# Altium schematic sheet USB_ETH_Sch.SchDoc
size A; PageSetup: Record=PageOptions|CenterHorizontal=True|CenterVertical=True|PrintScale=1.11|XCorrection=1.00|YCorrection=1.00|PrintKind=0|BorderSize=5000000|LeftOffset=0|BottomOffset=0|Orientation=2|PaperLength=1000|PaperWidth=1000|Scale=100|PaperSource=7|PrintQuality=-4|MediaType=1|DitherType=10|PaperKind=Letter|PrintScaleMode=1
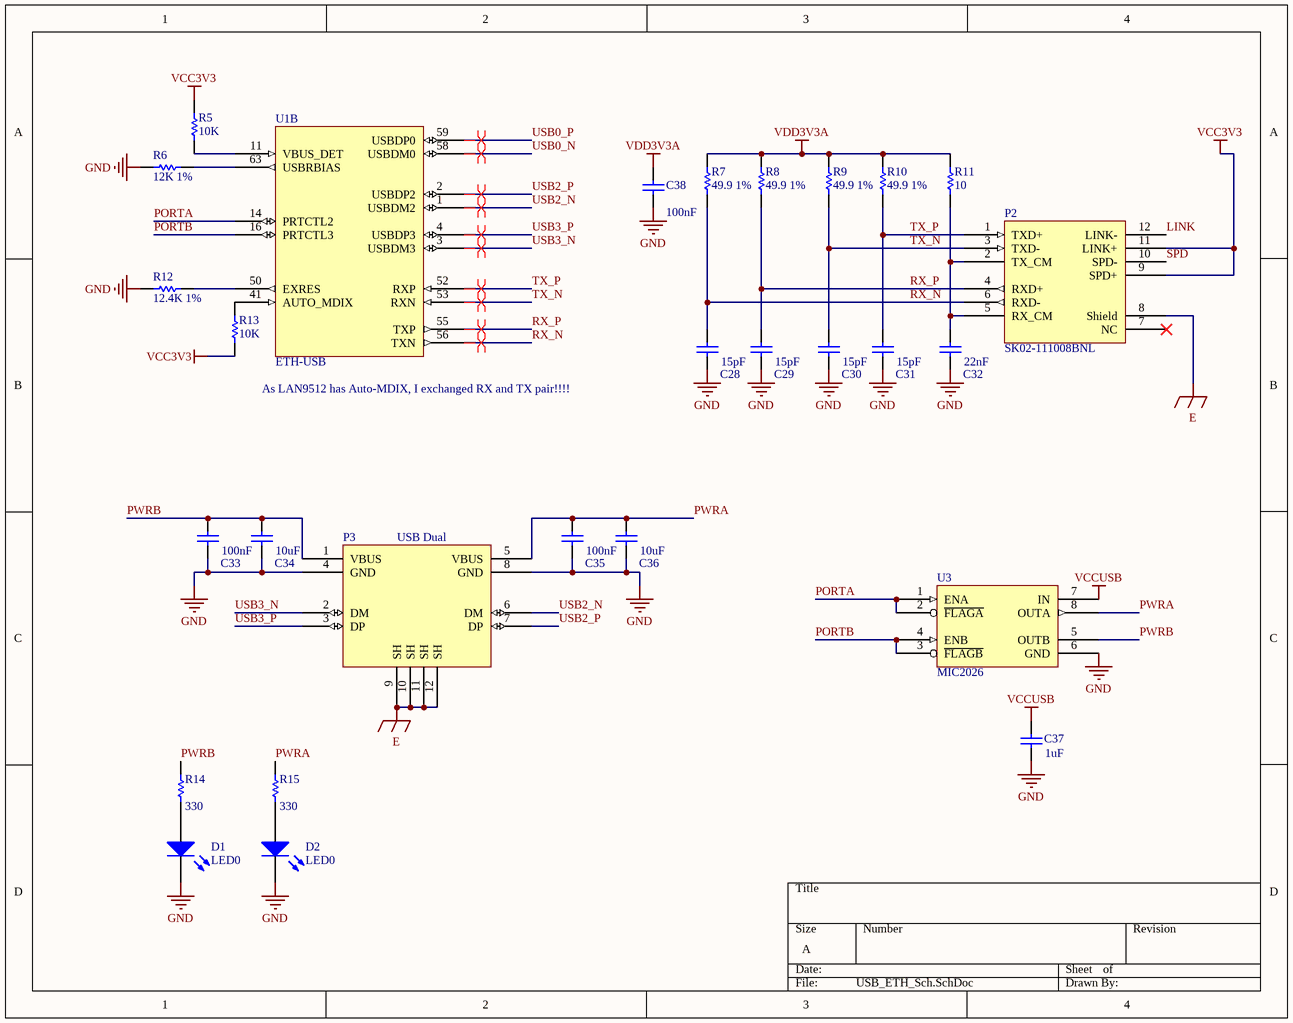
[diagram p0: USB_ETH_Sch.SchDoc]

## Parts
C28  value 15pF  [C0805]  (hidden comment: Cap)
C29  value 15pF  [C0805]  (hidden comment: Cap)
C30  value 15pF  [C0805]  (hidden comment: Cap)
C31  value 15pF  [C0805]  (hidden comment: Cap)
C32  value 22nF  [C0805]  (hidden comment: Cap)
C33  value 100nF  [C0805]  (hidden comment: Cap)
C34  value 10uF  [C0805]  (hidden comment: Cap)
C35  value 100nF  [C0805]  (hidden comment: Cap)
C36  value 10uF  [C0805]  (hidden comment: Cap)
C37  value 1uF  [C0805]  (hidden comment: Cap)
C38  value 100nF  [C0805]  (hidden comment: Cap)
D1  LED0  [SMD_LED_1206]
D2  LED0  [SMD_LED_1206]
P2  SK02-111008BNL  [RJ45+MAG]
P3  USB Dual  [USB_Duble]
R5  value 10K  [c0805]  (hidden comment: Res1)
R6  value 12K 1%  [c0805]  (hidden comment: Res1)
R7  value 49.9 1%  [c0805]  (hidden comment: Res1)
R8  value 49.9 1%  [c0805]  (hidden comment: Res1)
R9  value 49.9 1%  [c0805]  (hidden comment: Res1)
R10  value 49.9 1%  [c0805]  (hidden comment: Res1)
R11  value 10  [c0805]  (hidden comment: Res1)
R12  value 12.4K 1%  [c0805]  (hidden comment: Res1)
R13  value 10K  [c0805]  (hidden comment: Res1)
R14  value 330  [C1206]  (hidden comment: Res1)
R15  value 330  [C1206]  (hidden comment: Res1)
U1  ETH-USB  [QFN64]  (part B of 3)
U3  MIC2026  [SSOP8]

## Nets
E: P2.8(Shield) P3.9(SH) P3.10(SH) P3.11(SH) P3.12(SH)
GND: C28.1 C29.1 C30.1 C31.1 C32.1 C33.1 C34.1 C35.1 C36.1 C37.1 C38.1 D1.2(K) D2.2(K) P3.4(GND) P3.8(GND) R6.1 R12.1 U3.6(GND)
VCC3V3: P2.9(SPD+) P2.11(LINK+) R5.1 R13.1
VCCUSB: C37.2 U3.7(IN)
VDD3V3A: C38.2 R7.2 R8.2 R9.2 R10.2 R11.2
LINK: P2.12(LINK-)
PORTA: U1.14(PRTCTL2) U3.1(ENA) U3.2(~{FLAGA})
PORTB: U1.16(PRTCTL3) U3.3(~{FLAGB}) U3.4(ENB)
PWRA: C35.2 C36.2 P3.5(VBUS) R15.2 U3.8(OUTA)
PWRB: C33.2 C34.2 P3.1(VBUS) R14.2 U3.5(OUTB)
RX_N: C28.2 P2.6(RXD-) R7.1 U1.56(TXN)
RX_P: C29.2 P2.4(RXD+) R8.1 U1.55(TXP)
SPD: P2.10(SPD-)
TX_N: C30.2 P2.3(TXD-) R9.1 U1.53(RXN)
TX_P: C31.2 P2.1(TXD+) R10.1 U1.52(RXP)
USB0_N: U1.58(USBDM0)
USB0_P: U1.59(USBDP0)
USB2_N: P3.6(DM) U1.1(USBDM2)
USB2_P: P3.7(DP) U1.2(USBDP2)
USB3_N: P3.2(DM) U1.3(USBDM3)
USB3_P: P3.3(DP) U1.4(USBDP3)
NetC32_2: C32.2 P2.2(TX_CM) P2.5(RX_CM) R11.1
NetD1_1: D1.1(A) R14.1
NetD2_1: D2.1(A) R15.1
NetR5_2: R5.2 U1.11(VBUS_DET)
NetR6_2: R6.2 U1.63(USBRBIAS)
NetR12_2: R12.2 U1.50(EXRES)
NetR13_2: R13.2 U1.41(AUTO_MDIX)

Not connected (* = marked no-connect by the designer): P2 7(NC)*

## Layout directives
differential pair: RX_N, RX_P, TX_N, TX_P, USB0_N, USB0_P, USB2_N, USB2_P, USB3_N, USB3_P

## Notes on the sheet
- As LAN9512 has Auto-MDIX, I exchanged RX and TX pair!!!!

## Library data of the parts
C28-C38 = Cap: Capacitor; Published: 8-Jun-2000; LatestRevisionDate: 17-Jul-2002; LatestRevisionNote: Re-released for DXP Platform.; PackageReference: RAD-0.3; Publisher: Altium Limited; PackageDescription: Radial Cap, Thru-Hole; 2 Leads; 0.3 in Pin Spacing
D1 D2 = LED0: Typical INFRARED GaAs LED; Published: 8-Jun-2000; LatestRevisionDate: 08-Jul-2005; LatestRevisionNote: Mech Layer 1 removed.; PackageReference: LED-0; Publisher: Altium Limited; PackageDescription: LED; 2 Leads
P2 = SK02-111008BNL: Ethernet
P3 = USB_Double_Female
R5-R15 = Res1: Resistor; Published: 8-Jun-2000; LatestRevisionDate: 17-Jul-2002; LatestRevisionNote: Re-released for DXP Platform.; PackageReference: AXIAL-0.3; Publisher: Altium Limited; PackageDescription: Axial Device, Thru-Hole; 2 Leads; 0.3 in Pin Spacing
U1 = LAN9512: USB Hub to LAN connevtor